# EAGLE design senzory (EAGLE 9.4.1)
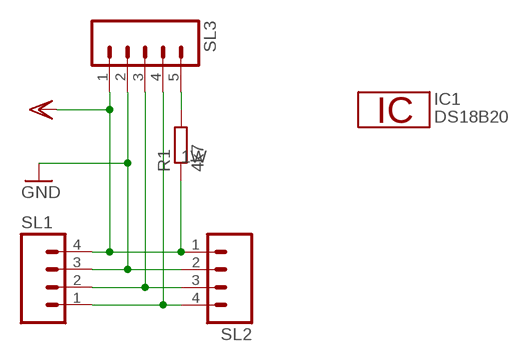
[diagram p0: schematic, sheet 1]

## Parts
IC1  DS18B20  [TO92-]
R1  4k7  R-EU_0204/7  [0204/7]
SL1  M04  [04P]
SL2  M04  [04P]
SL3  M05  [05P]

## Nets
1W: R1.2 SL3.5
GND: SL1.3 SL2.2 SL3.2
SCL: SL1.2 SL2.3 SL3.3
SDA: SL1.1 SL2.4 SL3.4
VDD: R1.1 SL1.4 SL2.1 SL3.1

## Power pins joined to a net without a drawn wire
1W: IC1.2
GND: IC1.1
VDD: IC1.3

## Library data of the parts
IC1 = 1wire:DS18B20: Programmable Resolution Digital Thermometer This chip provides a onewire thermosensor with approx. 0.5�C accuracy. A programmable over/undertemperure alarm is available. The precision can be set from 9..12 bits. Notes: Vdd must be applied for accurate measurements at low temperatures, as the parasite power circuit otherwise heats the sensor. If parasite power is used, Vdd has to be connected to GND. The DS1822 is a low-cost thermometer chip, the DS18S20 is similar to the DS18B20, but with 9 Bit precision only. Author: Jan Kandziora <jjj@gmx.de>
R1 = resistor:R-EU_: RESISTOR, European symbol
SL1 SL2 = con-amp-quick:M04: AMP QUICK CONNECTOR; OC_FARNELL: unknown; OC_NEWARK: unknown
SL3 = con-amp-quick:M05: AMP QUICK CONNECTOR; OC_FARNELL: unknown; OC_NEWARK: unknown

## Board
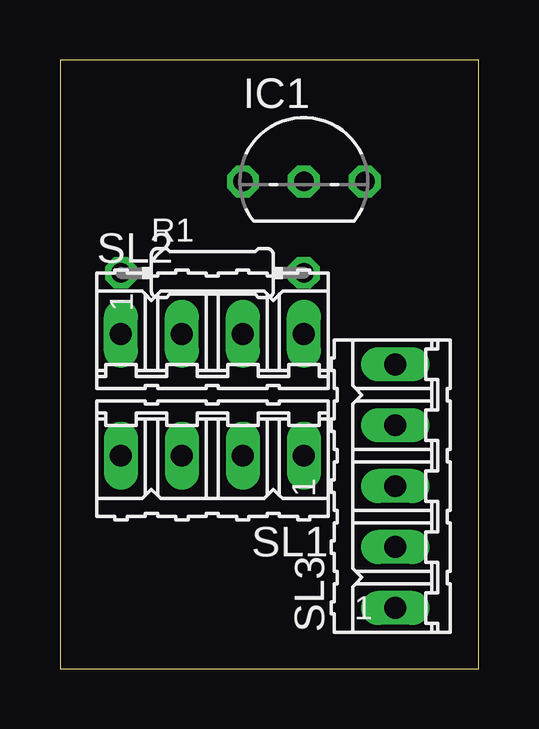
[diagram p1: board, top side]
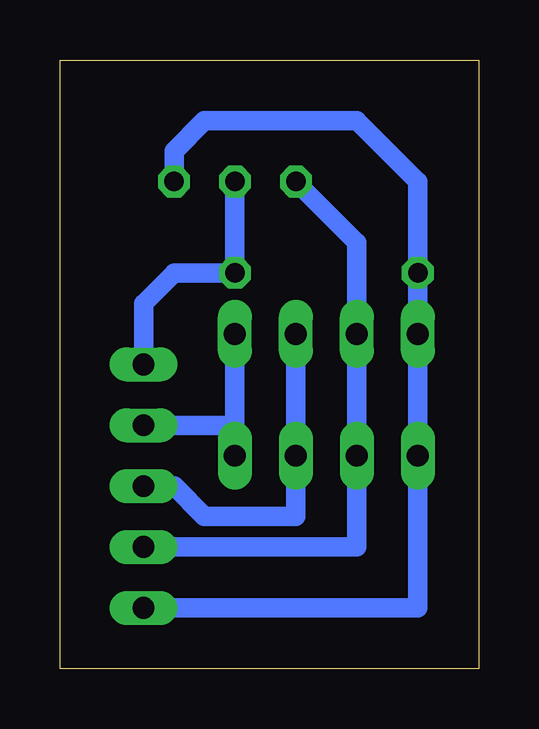
[diagram p2: board, bottom side, seen from below]

Size 17.45 x 25.39 mm. Coordinates in mm from the lower left corner, seen from the top.
Outline: 0,0 17.45,0 17.45,25.39 0,25.39 0,0
Copper layers (1*16): Top 0.035mm / dielectric 1.5mm / Bottom 0.035mm
Design rules "default": minimum track width 6mil, minimum drill 0.35mm, track to track 6mil, track to pad 6mil, pad to pad 6mil, via to via 6mil, smd to smd 6mil, copper to edge 40mil, drill to drill 6mil, minimum pad ring 10mil, minimum via ring 8mil, stop-mask expansion 4mil, vias tented up to drill 0mil, thermal gap 10mil

### Footprints (pad centres in the part's own frame; a part is rotated, then mirrored left to right if it is on the bottom)
TO92- = drill 0.813 octagon: 1 -2.54,0; 2 0,0; 3 2.54,0
0204/7 = drill 0.813 octagon: 1 -3.81,0; 2 3.81,0
04P = drill 0.914 long: 1 -3.81,0; 2 -1.27,0; 3 1.27,0; 4 3.81,0
05P = drill 0.914 long: 1 -5.08,0; 2 -2.54,0; 3 0,0; 4 2.54,0; 5 5.08,0

### Placement (x,y rotation side)
IC1  10.16,20.32 0 top
R1  6.35,16.51 0 top
SL1  6.35,8.89 180 top
SL2  6.35,13.97 0 top
SL3  13.97,7.62 90 top

### Tracks (layer width: path | path; a pad name or v marks a point on that pad's centre or on a via)
1W
  Bottom 0.813: SL3.5 13.97,15.24 12.7,16.51 R1.2 IC1.2
GND
  Bottom 0.813: SL3.2 5.08,5.08 SL1.3 SL2.2 5.08,17.78 IC1.1
SCL
  Bottom 0.813: SL3.3 12.7,7.62 11.43,6.35 7.62,6.35 SL1.2 SL2.3
SDA
  Bottom 0.813: SL2.4 10.16,10.16 | 10.16,10.16 SL1.1 | SL3.4 10.16,10.16
VDD
  Bottom 0.813: SL3.1 2.54,2.54 SL1.4 SL2.1 R1.1 2.54,20.32 5.08,22.86 11.43,22.86 12.7,21.59 IC1.3